# EasyEDA Pro project 视觉Dual Driver.epro

# Schematic Schematic2_1
Create Date: 2024-07-19; Page Name: P1; Project Name: 视觉Dual Driver; Schematic Name: Schematic2; Update Date: 2024-08-02; Company: 嘉立创EDA; Page Size: A4; Version: V1.0
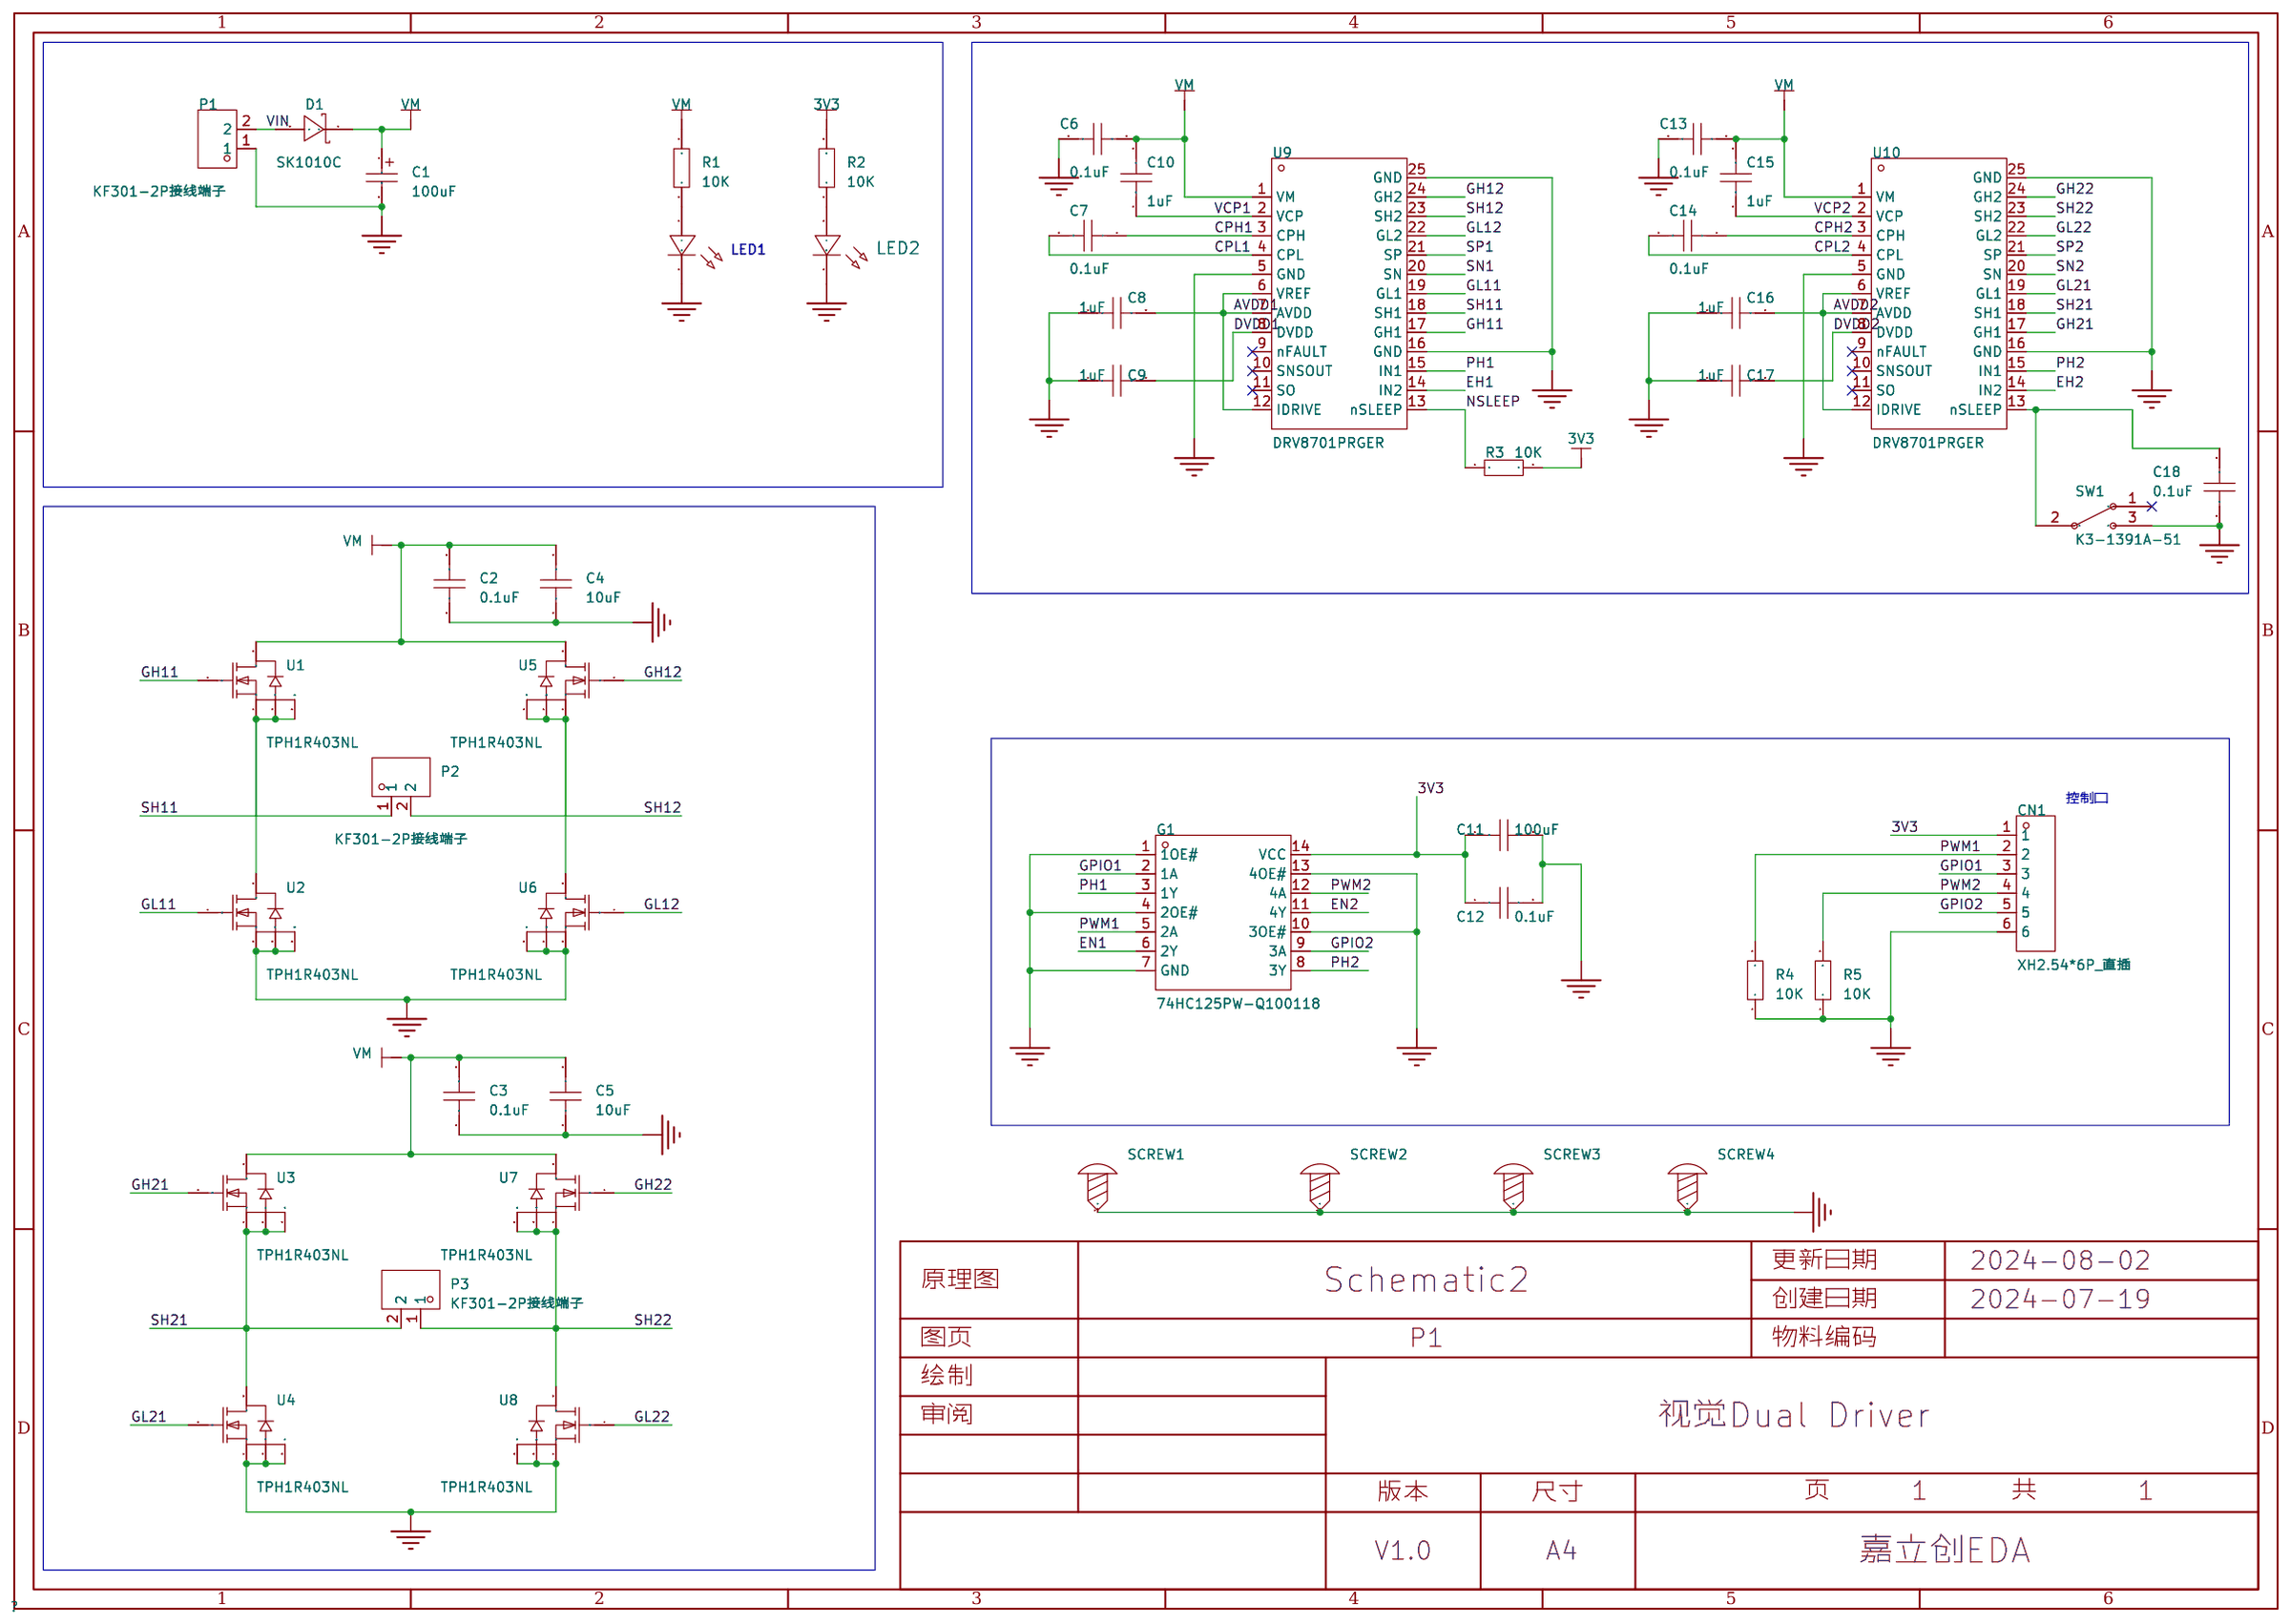
[diagram p0: schematic sheet]

## Parts
C1  100uF  [C_Ele_SMD_3x5.4mm]
C2  0.1uF  [C0603]
C3  0.1uF  [C0603]
C4  10uF  [C0603]
C5  10uF  [C0603]
C6  0.1uF  [C0603]
C7  0.1uF  [C0603]
C8  1uF  [C0603]
C9  1uF  [C0603]
C10  1uF  [C0603]
C11  100uF  [C0402]
C12  0.1uF  [C0402]
C13  0.1uF  [C0603]
C14  0.1uF  [C0603]
C15  1uF  [C0603]
C16  1uF  [C0603]
C17  1uF  [C0603]
C18  0.1uF  [C0402]
CN1  XH2.54*6P_直插  [CONN-TH_XH2.54-6P]
D1  SK1010C  [SMC_L7.1-W6.2-LS8.1-RD]
G1  74HC125PW-Q100118  [TSSOP-14_L5.0-W4.4-P0.65-LS6.4-BL]
LED1  -  [LED_0603]
LED2  -  [LED_0402]
P1  KF301-2P接线端子  [CONN-TH_XY301V-A-5.0-2P]
P2  KF301-2P接线端子  [CONN-TH_XY301V-A-5.0-2P]
P3  KF301-2P接线端子  [CONN-TH_XY301V-A-5.0-2P]
R1  10K  [R0603]
R2  10K  [R0603]
R3  10K  [R0603]
R4  10K  [R0603]
R5  10K  [R0603]
SCREW1  -  [M2螺丝]
SCREW2  -  [M2螺丝]
SCREW3  -  [M2螺丝]
SCREW4  -  [M2螺丝]
SW1  K3-1391A-51  [SW-TH_MSS22D18GX]
U1  TPH1R403NL  [TDSON-8_L5.9-W5.2-P1.27-BL]
U2  TPH1R403NL  [TDSON-8_L5.9-W5.2-P1.27-BL]
U3  TPH1R403NL  [TDSON-8_L5.9-W5.2-P1.27-BL]
U4  TPH1R403NL  [TDSON-8_L5.9-W5.2-P1.27-BL]
U5  TPH1R403NL  [TDSON-8_L5.9-W5.2-P1.27-BL]
U6  TPH1R403NL  [TDSON-8_L5.9-W5.2-P1.27-BL]
U7  TPH1R403NL  [TDSON-8_L5.9-W5.2-P1.27-BL]
U8  TPH1R403NL  [TDSON-8_L5.9-W5.2-P1.27-BL]
U9  DRV8701PRGER  [VQFN-24_L4.0-W4.0-P0.50-BL-EP2.8]
U10  DRV8701PRGER  [VQFN-24_L4.0-W4.0-P0.50-BL-EP2.8]

## Library data of the parts
C1 = C_Ele_SMD_3x5.4mm: Supplier Footprint: SMD,3x5.4mm
C2-C10 C13-C17 = CAP_0603: Supplier Footprint: 0603
C11 C12 C18 = CAP_0402: Supplier Footprint: 0402
CN1 = XH2.54*6P_直插: Supplier Part: C9900008614; Supplier Footprint: XH2.54_6P; JLCPCB Part Class: 扩展库; Supplier: LCSC
D1 = SK1010C: 二极管配置:独立式;正向压降(Vf):850mV@10A;直流反向耐压(Vr):100V;整流电流:10A;; LCSC Part Name: 电压:100V 电流:10A; Supplier Part: C65020; Manufacturer: MDD(辰达半导体); Supplier Footprint: SMC(DO-214AB); JLCPCB Part Class: 扩展库; Datasheet: https://atta.szlcsc.com/upload/public/pdf/source/20230314/AF3FAFCB90266CA9DFE97B86F1DC38A5.pdf; Supplier: LCSC; Diode Configuration: 独立式; Forward Voltage (Vf@If): 850mV@10A; Reverse Voltage (Vr): 100V; Rectified Current: 10A; Reverse Leakage Current (Ir): 1mA@100V
G1 = 74HC125PW-Q100118: 电源电压:2V~6V;每个元件位数:1;灌电流(IOL):7.8mA;拉电流(IOH):7.8mA;; Supplier Part: C3756286; Manufacturer: Nexperia(安世); Supplier Footprint: TSSOP-14; JLCPCB Part Class: 扩展库; Datasheet: https://atta.szlcsc.com/upload/public/pdf/source/20230811/D75C3913735B856D8FD2FEF6C838428E.pdf; Supplier: LCSC; output type: 三态; Supply Voltage: 2V~6V; Number of Bits per Element: 1; Sink Current: 7.8mA; Source Current: 7.8mA; Logic Family: 74HC; Operating Temperature: -40℃~+125℃
LED1 = LED_0603-G: Supplier Footprint: 0603
LED2 = LED_0402-R: Supplier Footprint: 0402
P1-P3 = KF301-2P接线端子: Supplier Part: C9900016950; Supplier Footprint: CK301-2P; JLCPCB Part Class: 扩展库; Supplier: LCSC
R1-R5 = Res_0603: Supplier Footprint: 0603
SCREW1-SCREW4 = M2螺丝: Supplier Footprint: 插件
SW1 = K3-1391A-51: 电路结构:单刀双掷;安装方式:直插;开关颜色:黑色;额定电压(DC):-;额定电流(AC):5A;额定电压(AC):120V;机械寿命:3万次;; LCSC Part Name: 直插双档 滑动开关; Supplier Part: C92655; Manufacturer: 韩国韩荣; Supplier Footprint: 插件; JLCPCB Part Class: 扩展库; Datasheet: https://atta.szlcsc.com/upload/public/pdf/source/20170922/C92655_1506073659100987365.pdf; Supplier: LCSC; Circuit: 单刀双掷; Actuator Style: 矩形柱状; Pin Style: PC引脚; Switch Length: 19.6mm; Switch Width: 6.6mm; Switch Height: 11.4mm; Mounting Style: 直插; Actuator Color: 黑色; Current Rating (AC): 5A; Voltage Rating (AC): 120V; Mechanical Life: 3万次; Operating Temperature: -25℃~+80℃
U1-U8 = TPH1R403NL_C19268167: Supplier Part: C19268167; Manufacturer: TECH PUBLIC(台舟); JLCPCB Part Class: 扩展库; Datasheet: https://atta.szlcsc.com/upload/public/pdf/source/20231201/E668D9B30DA1C5FDF2CA4EE637776407.pdf; Supplier: LCSC
U9 U10 = DRV8701PRGER: DRV8701 47V H 桥智能栅极驱动器; LCSC Part Name: 有刷直流电机驱动芯片 5.5V; Supplier Part: C114178; Manufacturer: TI(德州仪器); Supplier Footprint: VQFN-24-EP(4x4); JLCPCB Part Class: 扩展库; Datasheet: https://www.ti.com/cn/lit/gpn/drv8701; Supplier: LCSC

## Nets
3V3: C11.1 C12.1 CN1.1 G1.14(VCC) R2.2 R3.2
AVDD1: C8.2 U9.6(VREF) U9.7(AVDD) U9.12(IDRIVE)
AVDD2: C16.2 U10.6(VREF) U10.7(AVDD) U10.12(IDRIVE)
DVDD1: C9.2 U9.8(DVDD)
DVDD2: C17.2 U10.8(DVDD)
GND: C1.2 C2.1 C3.1 C4.1 C5.1 C6.2 C8.1 C9.1 C11.2 C12.2 C13.2 C16.1 C17.1 C18.1 CN1.6 G1.1(1OE#) G1.4(2OE#) G1.7(GND) G1.10(3OE#) G1.13(4OE#) LED1.1(C) LED2.1(C) P1.1 R4.1 R5.1 SCREW1.1 SCREW2.1 SCREW3.1 SCREW4.1 SW1.3 U2.1(S) U2.2(S) U2.3(S) U4.1(S) U4.2(S) U4.3(S) U6.1(S) U6.2(S) U6.3(S) U8.1(S) U8.2(S) U8.3(S) U9.5(GND) U9.16(GND) U9.25(GND) U10.5(GND) U10.16(GND) U10.25(GND)
VIN: D1.2(A) P1.2
CPH1: C7.1 U9.3(CPH)
CPH2: C14.1 U10.3(CPH)
CPL1: C7.2 U9.4(CPL)
CPL2: C14.2 U10.4(CPL)
EH1: U9.14(IN2)
EH2: U10.14(IN2)
EN1: G1.6(2Y)
EN2: G1.11(4Y)
GH11: U1.4(G) U9.17(GH1)
GH12: U5.4(G) U9.24(GH2)
GH21: U3.4(G) U10.17(GH1)
GH22: U7.4(G) U10.24(GH2)
GL11: U2.4(G) U9.19(GL1)
GL12: U6.4(G) U9.22(GL2)
GL21: U4.4(G) U10.19(GL1)
GL22: U8.4(G) U10.22(GL2)
GPIO1: CN1.3 G1.2(1A)
GPIO2: CN1.5 G1.9(3A)
NSLEEP: R3.1 U9.13(nSLEEP)
PH1: G1.3(1Y) U9.15(IN1)
PH2: G1.8(3Y) U10.15(IN1)
PWM1: CN1.2 G1.5(2A) R4.2
PWM2: CN1.4 G1.12(4A) R5.2
SH11: P2.1 U1.1(S) U1.2(S) U1.3(S) U2.5(D) U9.18(SH1)
SH12: P2.2 U5.1(S) U5.2(S) U5.3(S) U6.5(D) U9.23(SH2)
SH21: P3.2 U3.1(S) U3.2(S) U3.3(S) U4.5(D) U10.18(SH1)
SH22: P3.1 U7.1(S) U7.2(S) U7.3(S) U8.5(D) U10.23(SH2)
SN1: U9.20(SN)
SN2: U10.20(SN)
SP1: U9.21(SP)
SP2: U10.21(SP)
VCP1: C10.1 U9.2(VCP)
VCP2: C15.1 U10.2(VCP)
VM: C1.1 C2.2 C3.2 C4.2 C5.2 C6.1 C10.2 C13.1 C15.2 D1.1(K) R1.2 U1.5(D) U3.5(D) U5.5(D) U7.5(D) U9.1(VM) U10.1(VM)
$1N9434: C18.2 SW1.2 U10.13(nSLEEP)
Net-(LED1-2): LED1.2(A) R1.1
Net-(LED2-2): LED2.2(A) R2.1

Not connected (* = marked no-connect by the designer): SW1 1*; U9 9(nFAULT)* 10(SNSOUT)* 11(SO)*; U10 9(nFAULT)* 10(SNSOUT)* 11(SO)*

## Notes on the sheet
- 控制口

# Board PCB2_1
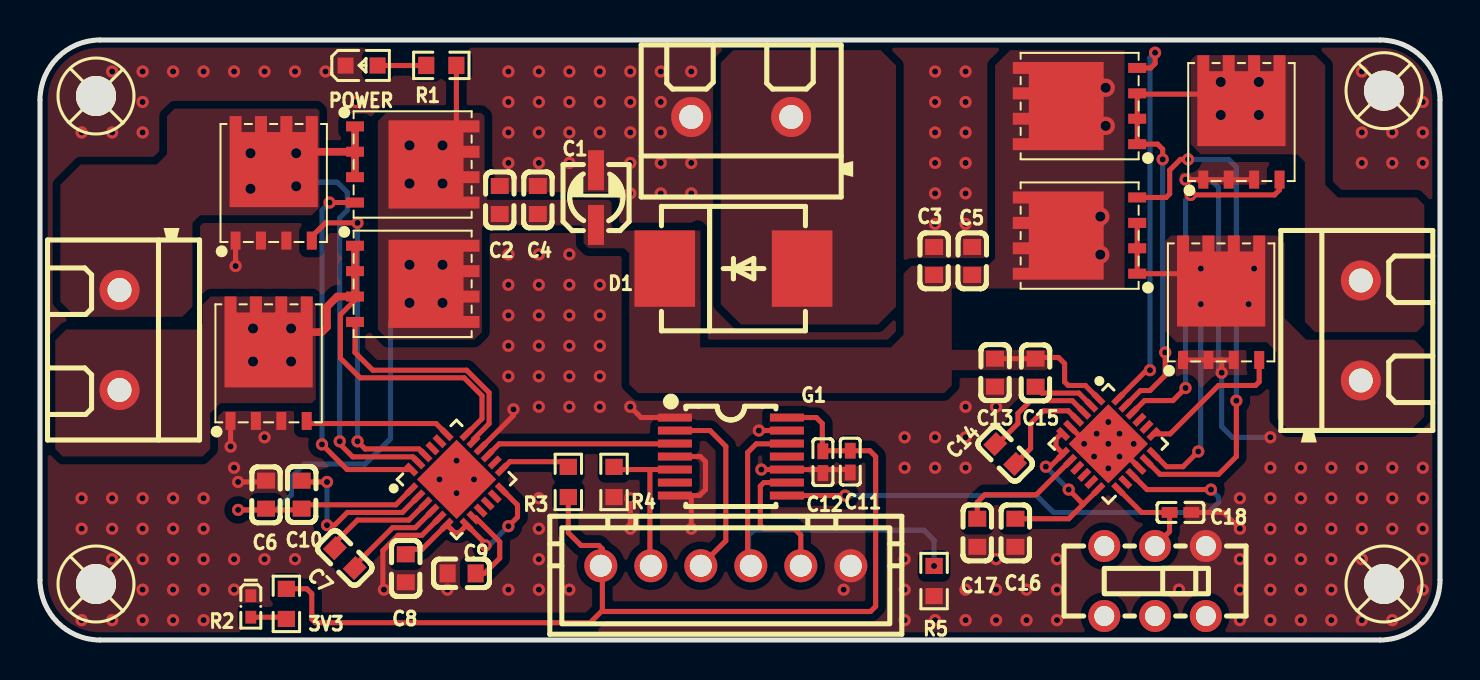
[diagram p1: board, top side]
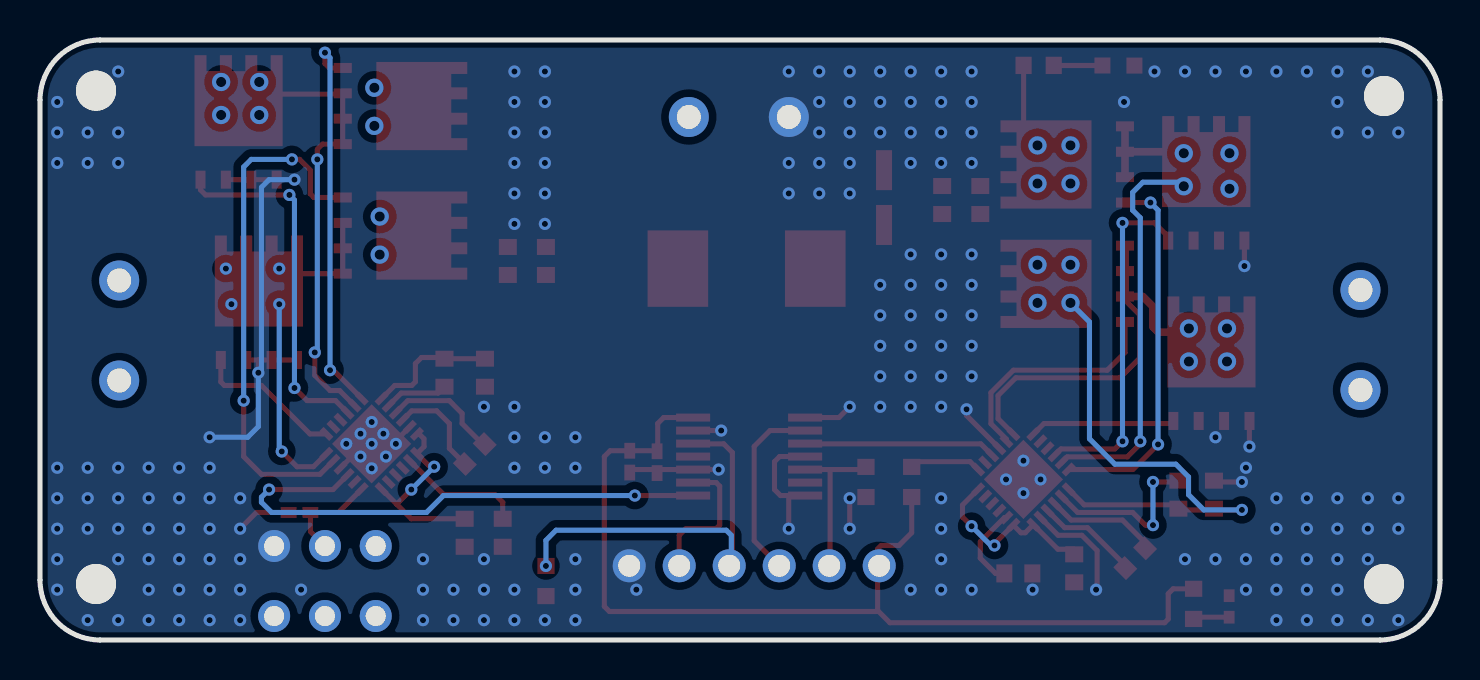
[diagram p2: board, bottom side, seen from below]

Outline 70 x 30 mm; copper layers: Top Layer, Bottom Layer. Coordinates in mm from the lower left corner of the outline.
Outline path: 0,27 0,3 arc(0.88,0.88) 3,0 67,0 arc(69.12,0.88) 70,3 70,27 arc(69.12,29.12) 67,30 3,30 arc(0.88,29.12) 0,27
Stack: Top Layer 0.035mm / Dielectric1 1.51mm FR4 er 4.5 / Bottom Layer 0.035mm

## Design rules (mm)
template: 自定义配置
spacing copperThickness1oz (default): track to track 0.102, other pairs 0.152 to 0.3
spacing copperThickness2oz: track to track 0.203, other pairs 0.152 to 0.3
track width copperThickness1oz (default): min 0.127, default 0.254, max 2.54
track width copperThickness2oz: min 0.203, default 0.254, max 2.54
differential pair differentialPair (default): width min 0.127, default 0.254, max 2.54; gap min 0.152, default 0.152
via viaSize (default): diameter min 0.5, default 0.61, max 10; hole min 0.3, default 0.305, max 6.299

## Placement (name value [footprint] x y rotation side)
3V3  -  [LED_0402]  10.54 1.68 270 top
C1  100uF  [C_Ele_SMD_3x5.4mm]  27.81 22.13 270 top
C2  0.1uF  [C0603]  22.99 22 270 top
C3  0.1uF  [C0603]  44.7 18.95 270 top
C4  10uF  [C0603]  24.89 22 270 top
C5  10uF  [C0603]  46.61 18.95 270 top
C6  0.1uF  [C0603]  11.3 7.27 90 top
C7  0.1uF  [C0603]  15.24 4.09 315 top
C8  1uF  [C0603]  18.29 3.58 90 top
C9  1uF  [C0603]  21.08 3.33 0 top
C10  1uF  [C0603]  13.08 7.27 270 top
C11  100uF  [C0402]  40.51 8.92 270 top
C12  0.1uF  [C0402]  39.15 8.89 270 top
C13  0.1uF  [C0603]  47.75 13.36 270 top
C14  0.1uF  [C0603]  48.26 9.3 315 top
C15  1uF  [C0603]  49.78 13.36 90 top
C16  1uF  [C0603]  48.77 5.36 90 top
C17  1uF  [C0603]  46.86 5.36 90 top
C18  0.1uF  [C0402]  57.02 6.38 180 top
CN1  XH2.54*6P_直插  [CONN-TH_XH2.54-6P]  34.29 3.71 0 top
D1  SK1010C  [SMC_L7.1-W6.2-LS8.1-RD]  34.67 18.57 0 top
G1  74HC125PW-Q100118  [TSSOP-14_L5.0-W4.4-P0.65-LS6.4-BL]  34.54 9.17 270 top
P1  KF301-2P接线端子  [CONN-TH_XY301V-A-5.0-2P]  35.06 26.15 0 top
P2  KF301-2P接线端子  [CONN-TH_XY301V-A-5.0-2P]  3.98 15 90 top
P3  KF301-2P接线端子  [CONN-TH_XY301V-A-5.0-2P]  66.04 15.48 270 top
POWER  -  [LED_0603]  16.13 28.73 0 top
R1  10K  [R0603]  20.07 28.73 0 top
R2  10K  [R0603]  12.32 1.81 90 top
R3  10K  [R0603]  26.42 7.9 270 top
R4  10K  [R0603]  28.7 7.9 90 top
R5  10K  [R0603]  44.7 2.95 90 top
SCREW1  -  [M2螺丝]  2.8 27.2 0 top
SCREW2  -  [M2螺丝]  2.8 2.8 0 top
SCREW3  -  [M2螺丝]  67.2 2.8 0 top
SCREW4  -  [M2螺丝]  67.2 27.47 0 top
SW1  K3-1391A-51  [SW-TH_MSS22D18GX]  55.75 2.95 0 top
U1  TPH1R403NL  [TDSON-8_L5.9-W5.2-P1.27-BL]  17.53 17.81 270 top
U2  TPH1R403NL  [TDSON-8_L5.9-W5.2-P1.27-BL]  11.43 12.73 0 top
U3  TPH1R403NL  [TDSON-8_L5.9-W5.2-P1.27-BL]  53.09 20.22 90 top
U4  TPH1R403NL  [TDSON-8_L5.9-W5.2-P1.27-BL]  59.06 15.78 0 top
U5  TPH1R403NL  [TDSON-8_L5.9-W5.2-P1.27-BL]  17.53 23.78 270 top
U6  TPH1R403NL  [TDSON-8_L5.9-W5.2-P1.27-BL]  11.68 21.75 0 top
U7  TPH1R403NL  [TDSON-8_L5.9-W5.2-P1.27-BL]  53.09 26.7 90 top
U8  TPH1R403NL  [TDSON-8_L5.9-W5.2-P1.27-BL]  60.07 24.79 0 top
U9  DRV8701PRGER  [VQFN-24_L4.0-W4.0-P0.50-BL-EP2.8]  20.83 8.03 315 top
U10  DRV8701PRGER  [VQFN-24_L4.0-W4.0-P0.50-BL-EP2.8]  53.42 9.81 225 top

## Footprints (pads in the part's own frame, mm; a bottom-side part is the same pattern mirrored in y, then rotated)
C0402
  rect 0.79x0.54 smd: 1(-0.545,0) 2(0.545,0)
C0603
  rect 0.8x0.9 smd: 1(-0.7,0) 2(0.7,0)
C_Ele_SMD_3x5.4mm
  rect 1.999x0.8 smd: 1(1.374,-0.014) 2(-1.364,-0.014)
CONN-TH_XH2.54-6P
  round 1.65 hole 1.1: 1(-6.25,0) 2(-3.75,0) 3(-1.25,0) 4(1.25,0) 5(3.75,0) 6(6.25,0)
CONN-TH_XY301V-A-5.0-2P
  round 2 hole 1.2: 1(-2.5,0) 2(2.5,0)
LED_0402
  rect 0.637x0.541 smd: 1(-0.538,0) 2(0.538,0)
LED_0603
  rect 0.8x0.8 smd: 1(-0.851,-0.01) 2(0.75,-0.005)
M2螺丝
  round 2 hole 2: 1(0,0)
R0603
  rect 0.806x0.864 smd: 1(-0.753,0) 2(0.753,0)
SMC_L7.1-W6.2-LS8.1-RD
  rect 3.03x3.82 smd: 1(-3.435,0) 2(3.435,0)
SW-TH_MSS22D18GX
  round 1.6 hole 1: 1(-2.54,1.75) 2(0,1.75) 3(2.54,1.75) 4(-2.54,-1.75) 5(0,-1.75) 6(2.54,-1.75)
TDSON-8_L5.9-W5.2-P1.27-BL
  rect 0.5x0.9 smd: 1(-1.905,-1.775) 2(-0.635,-1.775) 3(0.635,-1.775) 4(1.905,-1.775)
  custom 4.41x4.55 smd: 5(0,1.775)
TSSOP-14_L5.0-W4.4-P0.65-LS6.4-BL
  rect 0.4x1.7 smd: 1(-1.95,-2.8) 2(-1.3,-2.8) 3(-0.65,-2.8) 4(0,-2.8) 5(0.65,-2.8) 6(1.3,-2.8) 7(1.95,-2.8) 8(1.95,2.8) 9(1.3,2.8) 10(0.65,2.8) 11(0,2.8) 12(-0.65,2.8) 13(-1.3,2.8) 14(-1.95,2.8)
VQFN-24_L4.0-W4.0-P0.50-BL-EP2.8
  rect 0.3x0.7 smd: 1(-1.25,-1.95) 2(-0.75,-1.95) 3(-0.25,-1.95) 4(0.25,-1.95) 5(0.75,-1.95) 6(1.25,-1.95) 13(1.25,1.95) 14(0.75,1.95) 15(0.25,1.95) 16(-0.25,1.95) 17(-0.75,1.95) 18(-1.25,1.95)
  rect 0.7x0.3 smd: 7(1.95,-1.25) 8(1.95,-0.75) 9(1.95,-0.25) 10(1.95,0.25) 11(1.95,0.75) 12(1.95,1.25) 19(-1.95,1.25) 20(-1.95,0.75) 21(-1.95,0.25) 22(-1.95,-0.25) 23(-1.95,-0.75) 24(-1.95,-1.25)
  rect 2.8x2.8 smd: 25(0,0)

## Nets
As in the schematic, except:
GND: 3V3.1 C1.2 C2.1 C3.1 C4.1 C5.1 C6.2 C8.1 C9.1 C11.2 C12.2 C13.2 C16.1 C17.1 C18.1 CN1.6 G1.1 G1.4 G1.7 G1.10 G1.13 P1.1 POWER.1 R4.1 R5.1 SCREW1.1 SCREW2.1 SCREW3.1 SCREW4.1 SW1.3 U2.1 U2.2 U2.3 U4.1 U4.2 U4.3 U6.1 U6.2 U6.3 U8.1 U8.2 U8.3 U9.5 U9.16 U9.25 U10.5 U10.16 U10.25
$1N385: POWER.2 R1.1
$1N9111: 3V3.2 R2.1

Pads without a net: SW1 1 4 5 6; U9 9 10 11; U10 9 10 11

## Via types
v1: diameter 0.61, hole 0.305, Top Layer to Bottom Layer, 234 vias
v2: diameter 0.914, hole 0.508, Top Layer to Bottom Layer, 24 vias

## Routing (per net, layer and track width the routed paths; a pad name or vN(x,y) marks a point on that pad's centre or on a via; arc(x,y) is an arc through that point)
3V3: length 52
  Top Layer w0.254: 28.12,3.79 CN1.1 ; 28.12,3.79 28.12,4.55 27.94,4.73 27.05,4.73 26.42,5.36 26.42,7.28 ; 28.12,3.79 28.12,1.48 ; 28.12,1.48 27.51,0.86 13.77,0.86 13.59,1.04 13.59,2.31 13.34,2.56 R2.2 ; 28.12,1.48 28.17,1.42 41.53,1.42 41.78,1.68 41.78,9.17 41.49,9.46 C11.1 39.17,9.46 C12.1 39.12,9.47 39.12,10.82 38.82,11.12 G1.14
AVDD1: length 9.2
  Top Layer w0.254: v1(23.42,5.69) 23.88,6.15 23.88,6.75 U9.12 ; 18.29,4.54 19.1,4.54 20.33,5.77 20.74,5.36 20.96,5.36 21.32,5.73 21.32,5.77 22.28,4.81 v1(22.28,4.73)
  Bottom Layer w0.254: v1(23.42,5.69) 22.46,4.73 v1(22.28,4.73)
AVDD2: length 9.9
  Top Layer w0.254: 52.16,6.79 51.44,6.06 C16.2 ; 52.16,6.79 52.92,7.55 ; 52.16,6.79 51.44,7.52 v1(51.44,7.52) ; 51.15,10.3 51.04,10.3 50.8,10.06 50.8,9.67 51.15,9.31 50.5,8.66 v1(50.29,8.66)
  Bottom Layer w0.254: v1(51.44,7.52) v1(50.29,8.66)
DVDD1: length 4.2
  Top Layer w0.254: C9.2 22.22,3.33 22.99,4.09 22.99,4.91 21.78,6.12 U9.8
DVDD2: length 6.3
  Top Layer w0.254: C17.2 46.86,6.89 47.24,7.27 49.81,7.27 U10.8
GND: length 56.6
  Top Layer w0.254: G1.13 v1(35.94,10.47) ; v1(9.78,18.7) U6.1 ; G1.1 30.05,11.12 v1(29.51,11.66) ; C18.1 59.18,6.38 v1(60,5.56) ; 32.6,7.22 32.56,7.19 v1(32.56,5.56) ; 32.6,7.22 32.97,7.22 33.27,7.52 33.27,8.92 33.02,9.17 G1.4 ; 32.6,7.22 G1.7 ; U8.3 U8.2 U8.1 v1(57.28,23.02) ; v1(9.53,9.67) 9.53,10.95 U2.1 ; U9.5 19.09,5.23 17.91,5.23 17.14,4.47 17.14,2.57 v1(17.2,2.52) ; v1(36.07,8.52) G1.10 40.36,8.52 C11.2 ; U4.1 U4.2 59.08,14 ; 59.08,14 v1(59.08,13.36) ; 59.08,14 U4.3 ; v1(23.67,11.53) 23.67,11.23 U9.16 ; v1(29.51,7.09) v1(29.51,5.56) ; v1(52.21,9.81) 52.21,9.96 U10.5 ; v1(53.97,9.17) 54.41,9.17 U10.16 ; v1(9.91,7.9) 11.24,7.9 C6.2
  Bottom Layer w0.254: v1(61.52,10.14) 59.61,10.14 59.08,10.67 v1(59.08,13.36) 58.93,13.52 58.93,22.63 58.54,23.02 v1(57.28,23.02)
  vias: v1(2.08,25.38) v1(2.08,7.09) v1(2.08,5.56) v1(2.08,0.99) v1(3.61,28.42) v1(3.61,25.38) v1(3.61,7.09) v1(3.61,5.56) v1(3.61,4.04) v1(3.61,0.99) v1(5.13,28.42) v1(5.13,26.9) v1(5.13,25.38) v1(5.13,7.09) v1(5.13,5.56) v1(5.13,4.04) v1(5.13,2.52) v1(5.13,0.99) v1(6.66,28.42) v1(6.66,7.09) v1(6.66,5.56) v1(6.66,4.04) v1(6.66,2.52) v1(6.66,0.99) v1(8.18,28.42) v1(8.18,7.09) v1(8.18,5.56) v1(8.18,4.04) v1(8.18,2.52) v1(8.18,0.99) v1(9.7,28.42) v1(9.7,8.61) v1(9.7,4.04) v1(9.7,2.52) v1(11.23,28.42) v1(11.23,10.14) v1(11.23,4.04) v1(12.75,28.42) v1(12.75,4.04) v1(14.28,28.42) v1(15.8,26.9) v1(19.97,8.03) v1(20.37,2.52) v1(20.83,8.97) v1(20.83,7.34) v1(21.7,8.03) v1(23.42,28.42) v1(23.42,26.9) v1(23.42,25.38) v1(23.42,23.85) v1(23.42,19.28) v1(23.42,17.76) v1(23.42,16.23) v1(23.42,14.71) v1(23.42,13.19) v1(23.42,2.52) v1(24.94,28.42) v1(24.94,26.9) v1(24.94,25.38) v1(24.94,23.85) v1(24.94,19.28) v1(24.94,17.76) v1(24.94,16.23) v1(24.94,14.71) v1(24.94,13.19) v1(24.94,11.66) v1(24.94,7.09) v1(24.94,5.56) v1(24.94,4.04) v1(24.94,2.52) v1(26.47,28.42) v1(26.47,26.9) v1(26.47,25.38) v1(26.47,23.85) v1(26.47,19.28) v1(26.47,17.76) v1(26.47,16.23) v1(26.47,14.71) v1(26.47,13.19) v1(26.47,11.66) v1(26.47,2.52) v1(27.99,28.42) v1(27.99,26.9) v1(27.99,25.38) v1(27.99,17.76) v1(27.99,16.23) v1(27.99,14.71) v1(27.99,13.19) v1(27.99,11.66) v1(29.51,28.42) v1(29.51,26.9) v1(29.51,25.38) v1(29.51,23.85) v1(29.51,22.33) v1(31.04,28.42) v1(31.04,26.9) v1(31.04,25.38) v1(31.04,23.85) v1(31.04,22.33) v1(32.56,28.42) v1(32.56,23.85) v1(32.56,22.33) v1(40.18,2.52) v1(43.23,10.14) v1(43.23,8.61) v1(43.23,4.04) v1(43.23,2.52) v1(43.23,0.99) v1(44.75,28.42) v1(44.75,26.9) v1(44.75,25.38) v1(44.75,23.85) v1(44.75,22.33) v1(44.75,20.81) v1(44.75,10.14) v1(44.75,8.61) v1(44.75,0.99) v1(46.28,28.42) v1(46.28,26.9) v1(46.28,25.38) v1(46.28,23.85) v1(46.28,22.33) v1(46.28,20.81) v1(46.28,11.66) v1(46.28,10.14) v1(46.28,8.61) v1(46.28,2.52) v1(46.28,0.99) v1(47.8,11.66) v1(47.8,4.04) v1(47.8,2.52) v1(47.8,0.99) v1(49.33,2.52) v1(49.33,0.99) v1(50.85,4.04) v1(50.85,2.52) v1(50.85,0.99) v1(52.71,9.17) v1(52.83,10.31) v1(53.41,10.9) v1(53.41,9.81) v1(53.41,8.58) v1(53.97,10.31) v1(54.69,9.81) v1(56.95,2.52) v1(60,7.09) v1(60,4.04) v1(60,2.52) v1(60,0.99) v1(61.52,8.61) v1(61.52,7.09) v1(61.52,5.56) v1(61.52,4.04) v1(61.52,2.52) v1(61.52,0.99) v1(63.04,8.61) v1(63.04,7.09) v1(63.04,5.56) v1(63.04,4.04) v1(63.04,2.52) v1(63.04,0.99) v1(64.57,8.61) v1(64.57,7.09) v1(64.57,5.56) v1(64.57,4.04) v1(64.57,2.52) v1(64.57,0.99) v1(66.09,28.42) v1(66.09,25.38) v1(66.09,23.85) v1(66.09,8.61) v1(66.09,7.09) v1(66.09,5.56) v1(66.09,4.04) v1(66.09,0.99) v1(67.62,25.38) v1(67.62,23.85) v1(67.62,8.61) v1(67.62,7.09) v1(67.62,5.56) v1(67.62,0.99) v1(69.14,26.9) v1(69.14,25.38) v1(69.14,23.85) v1(69.14,8.61) v1(69.14,7.09) v1(69.14,5.56) v1(69.14,4.04) v1(69.14,2.52)
CPH1: length 5.5
  Top Layer w0.254: 14.75,4.71 14.75,4.87 15.88,6 18.44,6 19.27,6.83
CPH2: length 5.9
  Top Layer w0.254: 47.76,9.79 47.87,9.79 48.9,10.82 48.9,11.33 49.53,11.97 51.61,11.97 U10.3
CPL1: length 5
  Top Layer w0.254: U9.4 18.77,5.62 17.63,5.62 15.73,3.72
CPL2: length 5.1
  Top Layer w0.254: 48.75,8.8 49.53,9.58 49.53,10.82 50.16,11.46 51.41,11.46 U10.4
GH11: length 11.8
  Top Layer w0.254: U9.17 21.68,10.04 22.45,10.82 22.45,12.37 21.33,13.49 16.64,13.49 15.75,14.38 15.75,15.9 15.75,15.9
GH12: length 18.5
  Top Layer w0.254: 18.56,8.52 15.35,8.52 v1(14.1,9.78) ; v1(14.48,21.87) 15.75,21.87
  Bottom Layer w0.254: v1(14.1,9.78) 14.1,21.49 v1(14.48,21.87)
GH21: length 26.2
  Top Layer w0.254: U10.17 56,8.28 58.93,8.28 59.82,9.17 v1(59.82,11.97) ; 54.86,22.13 56.3,22.13 56.48,22.31 56.48,23.49 57.02,24.03 v1(57.4,24.03)
  Bottom Layer w0.254: v1(59.82,11.97) 59.82,23.65 59.44,24.03 v1(57.4,24.03)
GH22: length 19.7
  Top Layer w0.254: v1(55.5,13.49) 55.33,13.49 53.91,12.07 ; 54.86,28.6 55.54,28.6 55.75,28.82 v1(55.75,29.36)
  Bottom Layer w0.254: v1(55.5,13.49) 55.5,29.11 v1(55.75,29.36)
GL11: length 7.1
  Top Layer w0.254: 13.46,10.82 19.8,10.82 20.33,10.29
GL12: length 17.4
  Top Layer w0.254: U6.4 13.59,20.17 14.28,20.86 v1(15.88,20.86) ; v1(15.88,9.93) 16.26,9.55 18.95,9.55 U9.22
  Bottom Layer w0.254: v1(15.88,9.93) v1(15.88,20.86)
GL21: length 7.5
  Top Layer w0.254: U4.4 60.96,12.91 60.78,12.73 58.93,12.73 56.5,10.3 55.68,10.3
GL22: length 18
  Top Layer w0.254: v1(57.28,12.6) 56.65,11.97 55.23,11.97 U10.22 ; U8.4 61.98,22.51 61.72,22.25 v1(57.53,22.25)
  Bottom Layer w0.254: v1(57.28,12.6) 57.28,22 v1(57.53,22.25)
GPIO1: length 9.4
  Top Layer w0.254: CN1.3 34.29,4.96 34.29,9.68 33.5,10.47 G1.2
GPIO2: length 7.1
  Top Layer w0.254: CN1.5 38.04,5.24 37.72,5.56 36.19,5.56 36.02,5.74 36.02,7.69 36.19,7.87 G1.9
NSLEEP: length 3.6
  Top Layer w0.254: U9.13 23.1,8.52 23.5,8.92 26.15,8.92 R3.1
PH1: length 9.6
  Top Layer w0.254: U9.15 22.96,9.81 31.73,9.81 G1.3
PH2: length 27.2
  Top Layer w0.254: v1(58.55,7.52) 55.35,7.52 U10.15 ; G1.8 v1(40.26,7.22)
  Bottom Layer w0.254: v1(58.55,7.52) 58.93,7.14 58.93,6.89 58.42,6.38 50.67,6.38 49.83,7.22 v1(40.26,7.22)
PWM1: length 7.9
  Top Layer w0.254: 30.5,8.52 28.84,8.52 R4.2 ; 30.5,8.52 G1.5 ; 30.5,8.52 30.5,3.76 CN1.2
PWM2: length 20.3
  Top Layer w0.254: CN1.4 35.38,3.87 35.38,9.37 35.81,9.81 37.33,9.81 G1.12
  Bottom Layer w0.254: v1(44.7,3.7) 44.7,4.98 44.2,5.49 35.69,5.49 35.43,5.23 35.43,3.82 CN1.4
SH11: length 20.6
  Top Layer w0.254: 15.75,17.17 15.75,17 15.02,16.27 15.02,14.09 16,13.11 21.21,13.11 22.1,12.22 22.1,11.07 21.32,10.29
  Top Layer w0.381: v2(12.56,15.58) 12.74,15.39 14.1,15.39 14.35,15.65 14.35,16.67 14.86,17.17 15.75,17.17 15.75,19.71
  vias: v2(10.65,15.58) v2(10.65,13.92) v2(12.56,13.92)
SH12: length 25.4
  Top Layer w0.254: v1(14.99,9.93) 14.99,9.81 15.64,9.16 18.64,9.16 18.92,8.88
  Top Layer w0.381: v2(12.81,24.34) 12.88,24.41 15.75,24.41 ; 15.75,24.41 15.75,23.14 ; 15.75,24.41 15.75,25.68
  Bottom Layer w0.254: v1(14.99,9.93) 14.99,21.11 15.37,21.49 15.37,22.38 14.86,22.89 13.01,22.89 v2(12.81,22.69)
  vias: v2(10.52,24.34) v2(10.52,22.56)
SH21: length 16.1
  Top Layer w0.254: v1(57.91,9.43) 57.15,8.66 56.33,8.66 55.68,9.31 ; 54.86,20.86 54.86,18.32 57.78,18.32 v1(58.04,18.57)
  Bottom Layer w0.254: v1(57.91,9.43) 58.04,9.55 v1(58.04,16.79)
  vias: v1(60.43,16.79) v1(60.71,18.57)
SH22: length 23.4
  Top Layer w0.254: v1(56.13,24.03) 56.13,24.54 55.88,24.79 54.86,24.79 54.86,27.29 59.34,27.29 U8.5 ; 54.26,11.72 55.02,12.47 55.5,12.47 56.26,13.24 v1(56.26,14.38)
  Bottom Layer w0.254: v1(56.13,24.03) 56.13,14.51 v1(56.26,14.38)
  vias: v2(59.04,27.9) v2(59.04,26.25) v2(60.94,27.9) v2(60.94,26.25)
VCP1: length 8.6
  Top Layer w0.254: C10.1 13.15,7.9 v1(14.35,7.9) ; U9.2 18.12,6.38 15.37,6.38 14.73,5.74 v1(14.35,5.74)
  Bottom Layer w0.254: v1(14.35,5.74) v1(14.35,7.9)
VCP2: length 3.2
  Top Layer w0.254: C15.1 50.09,12.35 51.94,12.35 U10.2
VM: length 38
  Top Layer w0.254: U5.5 20.82,25.3 R1.2 ; 18.56,7.53 17.79,6.76 13.27,6.76 C10.2 13.02,6.5 v1(9.91,6.5) ; 52.92,12.07 52.26,12.73 51.41,12.73 51.23,12.91 51.23,13.82 50.93,14.12 49.84,14.12 C15.2 C13.1
  Bottom Layer w0.254: v2(18.48,16.86) 17.53,15.91 17.53,10.06 16.26,8.79 13.21,8.79 12.57,8.16 12.57,7.27 11.81,6.5 v1(9.91,6.5)
  vias: v2(18.48,24.73) v2(18.48,22.82) v2(18.48,18.76) v2(20.13,24.73) v2(20.13,22.82) v2(20.13,18.76) v2(20.13,16.86) v2(53.01,21.17) v2(53.01,19.27) v2(53.28,27.61) v2(53.28,25.71)
$1N385: length 2.4
  Top Layer w0.254: 16.88,28.72 19.31,28.72 R1.1
$1N9111: length 1.8
  Top Layer w0.254: 3V3.2 12.23,1.14 R2.1
$1N9434: length 5
  Top Layer w0.254: SW1.2 56.48,5.42 C18.2 55.08,6.38 U10.13

## Copper pours and planes (outline as drawn; the poured copper is in the pictures)
GND on Top Layer: -10.03,35.84 83.06,35.84 83.06,-3.15 -10.03,-3.15
GND on Bottom Layer: -7.87,32.29 77.6,32.29 77.6,-5.94 -7.87,-5.94
VIN on Top Layer: 34.04,29.49 42.8,29.49 42.8,15.78 34.04,15.78
SH11 on Top Layer: 0.76,17.17 13.79,17.17 13.79,9.17 0.76,9.17
SH12 on Top Layer: 1.02,26.57 13.97,26.57 13.97,16.16 1.02,16.16
SH21 on Top Layer: 56.26,20.23 69.22,20.23 69.22,10.53 56.26,10.53
SH22 on Top Layer: 57.53,29.24 69.22,29.24 69.22,15.39 57.53,15.39
VM on Top Layer: 16.89,26.35 33.02,26.35 33.02,15.01 16.89,15.01
VM on Top Layer: 29.46,29.49 54.23,29.49 54.23,12.35 29.46,12.35
VM on Top Layer: 45.34,14.51 50.49,14.51 50.49,13.49 45.34,13.49

Small or netless copper shapes (teardrops, artwork), in the pictures only: 1 on Top Layer
